# Altium schematic sheet ISL6236_DEMO_BOARD.SchDoc
size Tabloid
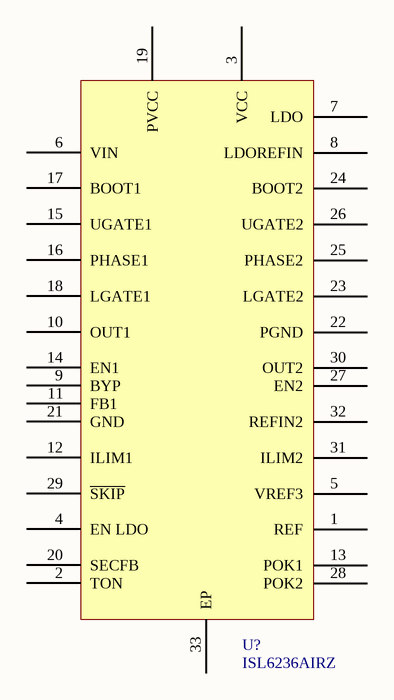
[diagram p0: ISL6236_DEMO_BOARD.SchDoc]

## Parts
U?  ISL6236AIRZ

## Nets

Not connected (* = marked no-connect by the designer): U? 1(REF) 2(TON) 3(VCC) 4(EN_LDO) 5(VREF3) 6(VIN) 7(LDO) 8(LDOREFIN) 9(BYP) 10(OUT1) 11(FB1) 12(ILIM1) 13(POK1) 14(EN1) 15(UGATE1) 16(PHASE1) 17(BOOT1) 18(LGATE1) 19(PVCC) 20(SECFB) 21(GND) 22(PGND) 23(LGATE2) 24(BOOT2) 25(PHASE2) 26(UGATE2) 27(EN2) 28(POK2) 29(~{SKIP}) 30(OUT2) 31(ILIM2) 32(REFIN2) 33(EP)

## Library data of the parts
U? = ISL6236AIRZ: IC MAIN PWR CTRLR QUAD 32-QFN; Manufacturer: Intersil; Voltage - Input: 4.5 V ~ 25 V; Number of Outputs: 4; Voltage - Output: Multiple; Supplier 1: Digi-Key; Manufacturer Part Number: ISL6236AIRZ; RoHS: RoHS Compliant; Category: Integrated Circuits (ICs); Stock 1: 0; Pricing 1: 600=3.818 (USD); Packaging: Tube; Part Status: Active; Applications: Controller, Notebook Power System; Operating Temperature: -40°C ~ 100°C; Mounting Type: Surface Mount; Package / Case: 32-VFQFN Exposed Pad; Supplier Device Package: 32-QFN (5x5); ComponentLink1URL: http://www.intersil.com/content/dam/Intersil/documents/isl6/isl6236a.pdf; ComponentLink1Description: http://www.intersil.com/content/dam/Intersil/documents/isl6/isl6236a.pdf; Supplier Part Number 1: ISL6236AIRZ-ND